# Altium schematic sheet [06] - NEON.SchDoc
size A3; DocumentNumber: 6; SheetNumber: 6; SheetTotal: 6
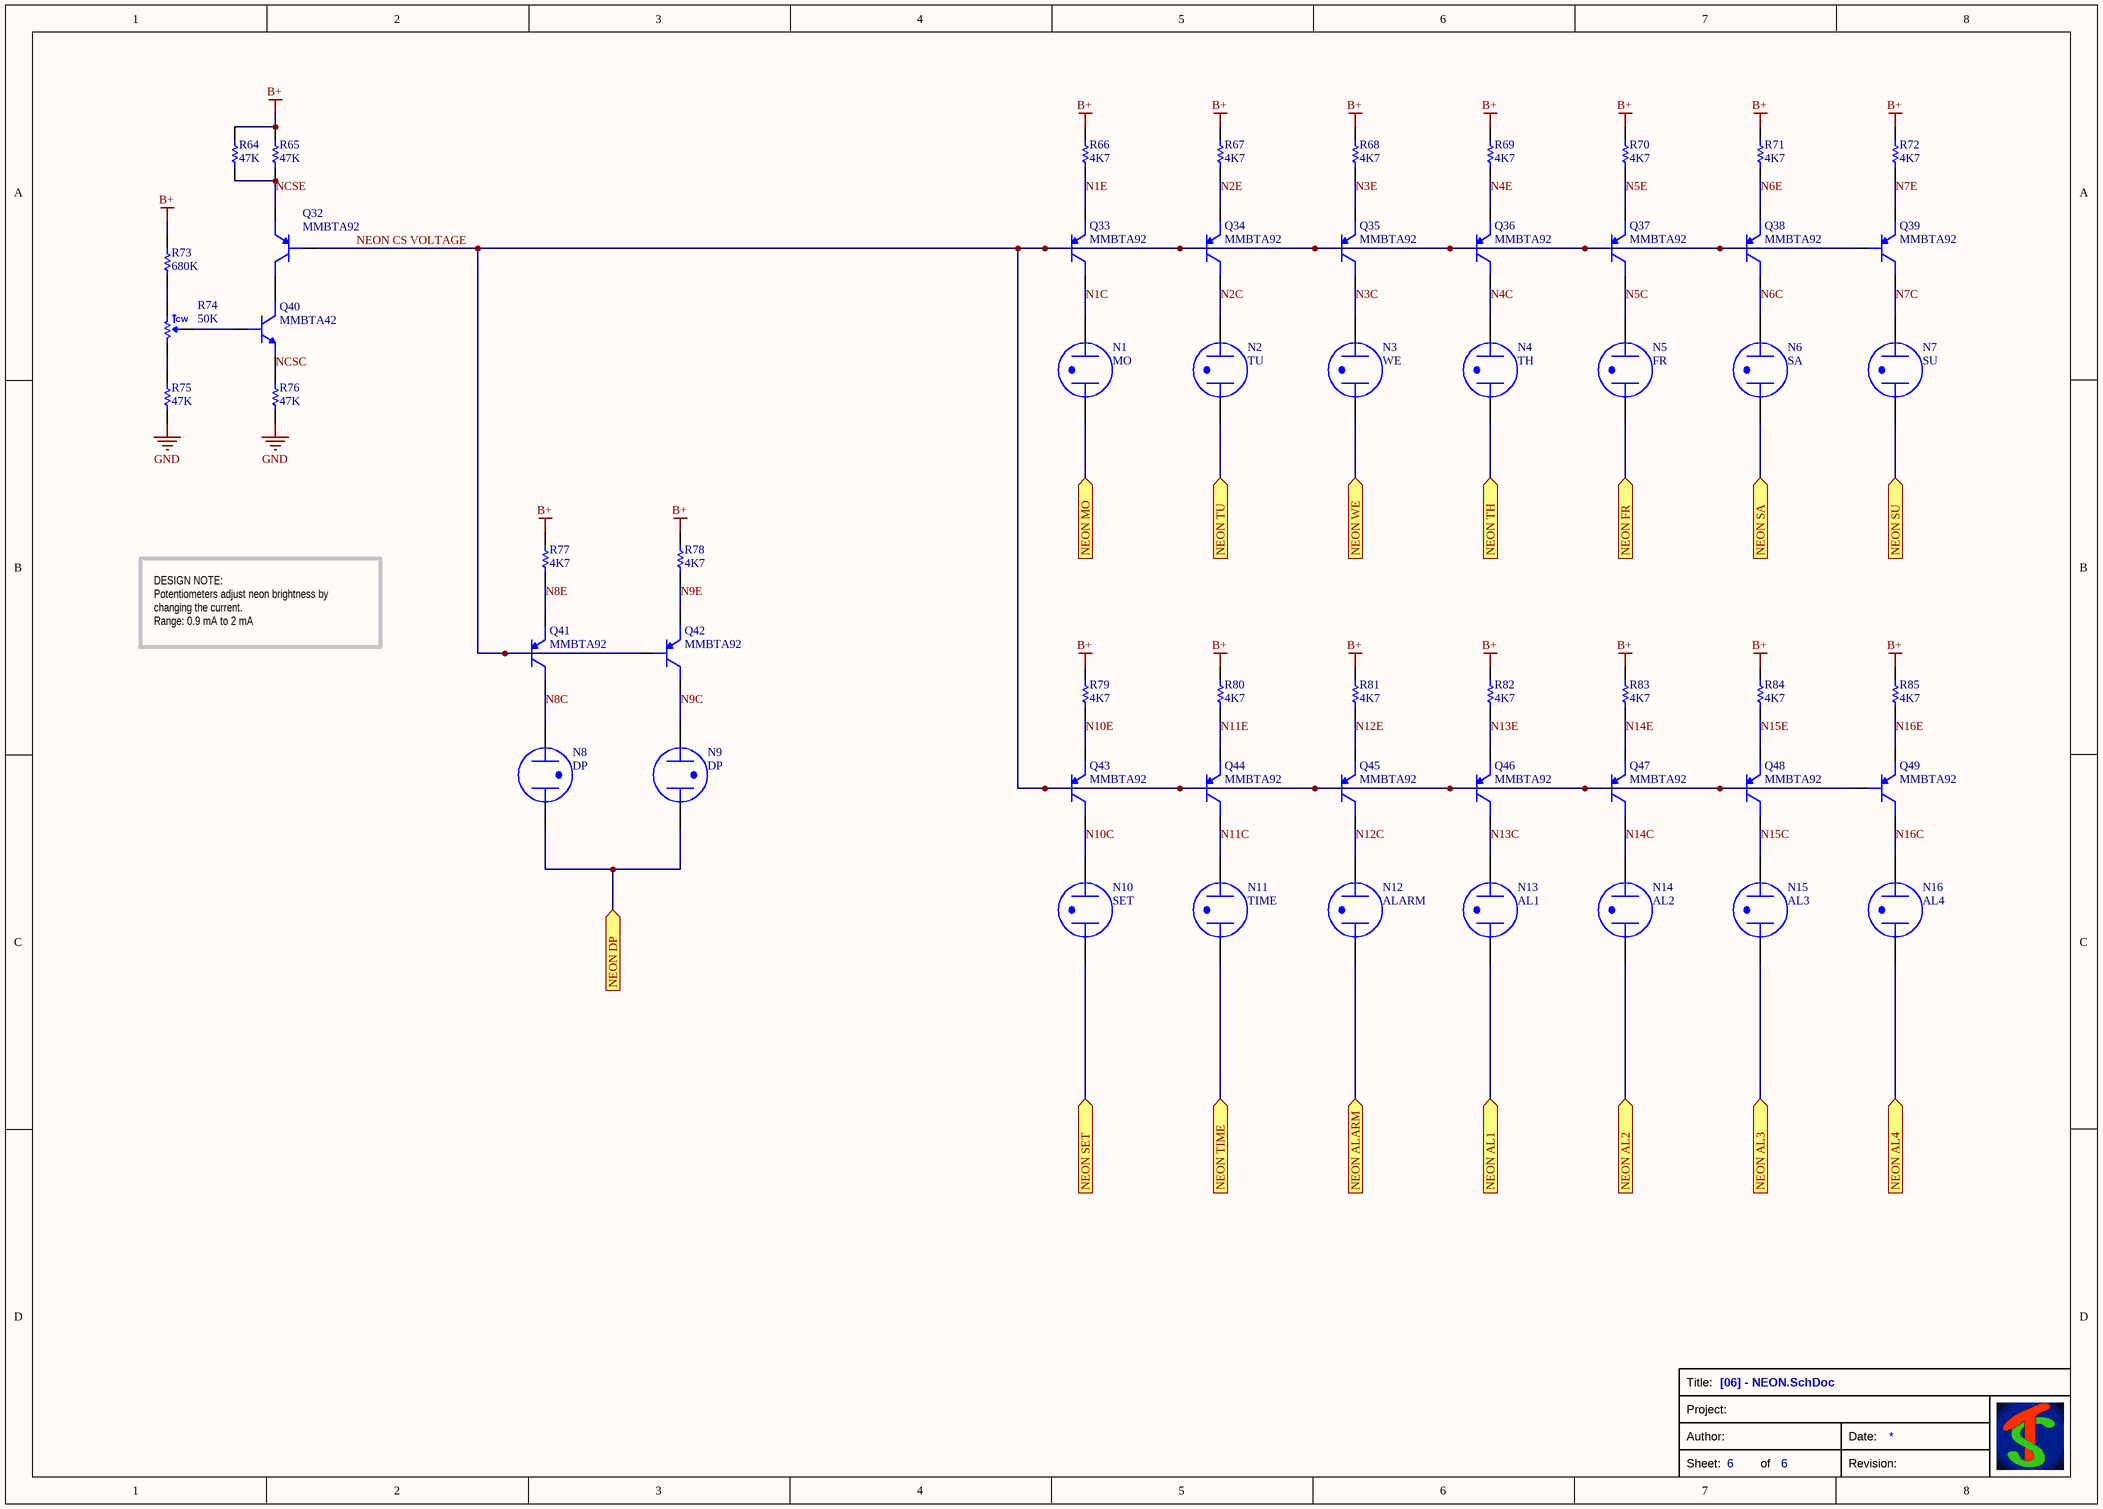
[diagram p0: [06] - NEON.SchDoc]

## Parts
N1  MO  [NE4 NEON LAMP]
N2  TU  [NE4 NEON LAMP]
N3  WE  [NE4 NEON LAMP]
N4  TH  [NE4 NEON LAMP]
N5  FR  [NE4 NEON LAMP]
N6  SA  [NE4 NEON LAMP]
N7  SU  [NE4 NEON LAMP]
N8  DP  [NE4 NEON LAMP]
N9  DP  [NE4 NEON LAMP]
N10  SET  [NE4 NEON LAMP]
N11  TIME  [NE4 NEON LAMP]
N12  ALARM  [NE4 NEON LAMP]
N13  AL1  [NE4 NEON LAMP]
N14  AL2  [NE4 NEON LAMP]
N15  AL3  [NE4 NEON LAMP]
N16  AL4  [NE4 NEON LAMP]
Q32  MMBTA92  [SOT95P240X110-3N]
Q33  MMBTA92  [SOT95P240X110-3N]
Q34  MMBTA92  [SOT95P240X110-3N]
Q35  MMBTA92  [SOT95P240X110-3N]
Q36  MMBTA92  [SOT95P240X110-3N]
Q37  MMBTA92  [SOT95P240X110-3N]
Q38  MMBTA92  [SOT95P240X110-3N]
Q39  MMBTA92  [SOT95P240X110-3N]
Q40  MMBTA42  [SOT95P240X110-3N]
Q41  MMBTA92  [SOT95P240X110-3N]
Q42  MMBTA92  [SOT95P240X110-3N]
Q43  MMBTA92  [SOT95P240X110-3N]
Q44  MMBTA92  [SOT95P240X110-3N]
Q45  MMBTA92  [SOT95P240X110-3N]
Q46  MMBTA92  [SOT95P240X110-3N]
Q47  MMBTA92  [SOT95P240X110-3N]
Q48  MMBTA92  [SOT95P240X110-3N]
Q49  MMBTA92  [SOT95P240X110-3N]
R64  value 47K  [RES-0805]  (hidden comment: RT0805FRE0747KL)
R65  value 47K  [RES-0805]  (hidden comment: RT0805FRE0747KL)
R66  value 4K7  [RES-0805]  (hidden comment: RT0805FRE134K7L)
R67  value 4K7  [RES-0805]  (hidden comment: RT0805FRE134K7L)
R68  value 4K7  [RES-0805]  (hidden comment: RT0805FRE134K7L)
R69  value 4K7  [RES-0805]  (hidden comment: RT0805FRE134K7L)
R70  value 4K7  [RES-0805]  (hidden comment: RT0805FRE134K7L)
R71  value 4K7  [RES-0805]  (hidden comment: RT0805FRE134K7L)
R72  value 4K7  [RES-0805]  (hidden comment: RT0805FRE134K7L)
R73  value 680K  [RES-1206]  (hidden comment: RT1206FRE07680KL)
R74  value 50K  [TC33X2503E]  (hidden comment: NEON)
R75  value 47K  [RES-0805]  (hidden comment: RT0805FRE0747KL)
R76  value 47K  [RES-0805]  (hidden comment: RT0805FRE0747KL)
R77  value 4K7  [RES-0805]  (hidden comment: RT0805FRE134K7L)
R78  value 4K7  [RES-0805]  (hidden comment: RT0805FRE134K7L)
R79  value 4K7  [RES-0805]  (hidden comment: RT0805FRE134K7L)
R80  value 4K7  [RES-0805]  (hidden comment: RT0805FRE134K7L)
R81  value 4K7  [RES-0805]  (hidden comment: RT0805FRE134K7L)
R82  value 4K7  [RES-0805]  (hidden comment: RT0805FRE134K7L)
R83  value 4K7  [RES-0805]  (hidden comment: RT0805FRE134K7L)
R84  value 4K7  [RES-0805]  (hidden comment: RT0805FRE134K7L)
R85  value 4K7  [RES-0805]  (hidden comment: RT0805FRE134K7L)

## Ports
NEON AL1 (in), NEON AL2 (in), NEON AL3 (in), NEON AL4 (in), NEON ALARM (in), NEON DP (in), NEON FR (in), NEON MO (in), NEON SA (in), NEON SET (in), NEON SU (in), NEON TH (in), NEON TIME (in), NEON TU (in), NEON WE (in)

## Nets
B+: R64.2 R65.2 R66.2 R67.2 R68.2 R69.2 R70.2 R71.2 R72.2 R73.2 R77.2 R78.2 R79.2 R80.2 R81.2 R82.2 R83.2 R84.2 R85.2
GND: R75.1 R76.1
N1C: N1.2 Q33.3(C)
N1E: Q33.2(E) R66.1
N2C: N2.2 Q34.3(C)
N2E: Q34.2(E) R67.1
N3C: N3.2 Q35.3(C)
N3E: Q35.2(E) R68.1
N4C: N4.2 Q36.3(C)
N4E: Q36.2(E) R69.1
N5C: N5.2 Q37.3(C)
N5E: Q37.2(E) R70.1
N6C: N6.2 Q38.3(C)
N6E: Q38.2(E) R71.1
N7C: N7.2 Q39.3(C)
N7E: Q39.2(E) R72.1
N8C: N8.1 Q41.3(C)
N8E: Q41.2(E) R77.1
N9C: N9.1 Q42.3(C)
N9E: Q42.2(E) R78.1
N10C: N10.2 Q43.3(C)
N10E: Q43.2(E) R79.1
N11C: N11.2 Q44.3(C)
N11E: Q44.2(E) R80.1
N12C: N12.2 Q45.3(C)
N12E: Q45.2(E) R81.1
N13C: N13.2 Q46.3(C)
N13E: Q46.2(E) R82.1
N14C: N14.2 Q47.3(C)
N14E: Q47.2(E) R83.1
N15C: N15.2 Q48.3(C)
N15E: Q48.2(E) R84.1
N16C: N16.2 Q49.3(C)
N16E: Q49.2(E) R85.1
NCSC: Q40.2(E) R76.2
NCSE: Q32.2(E) R64.1 R65.1
NEON AL1: N13.1 ; port NEON AL1
NEON AL2: N14.1 ; port NEON AL2
NEON AL3: N15.1 ; port NEON AL3
NEON AL4: N16.1 ; port NEON AL4
NEON ALARM: N12.1 ; port NEON ALARM
NEON CS VOLTAGE: Q32.1(B) Q33.1(B) Q34.1(B) Q35.1(B) Q36.1(B) Q37.1(B) Q38.1(B) Q39.1(B) Q41.1(B) Q42.1(B) Q43.1(B) Q44.1(B) Q45.1(B) Q46.1(B) Q47.1(B) Q48.1(B) Q49.1(B)
NEON DP: N8.2 N9.2 ; port NEON DP
NEON FR: N5.1 ; port NEON FR
NEON MO: N1.1 ; port NEON MO
NEON SA: N6.1 ; port NEON SA
NEON SET: N10.1 ; port NEON SET
NEON SU: N7.1 ; port NEON SU
NEON TH: N4.1 ; port NEON TH
NEON TIME: N11.1 ; port NEON TIME
NEON TU: N2.1 ; port NEON TU
NEON WE: N3.1 ; port NEON WE
NetQ32_3: Q32.3(C) Q40.3(C)
NetQ40_1: Q40.1(B) R74.2
NetR73_1: R73.1 R74.3
NetR74_1: R74.1 R75.2

## Notes on the sheet
- DESIGN NOTE:
  Potentiometers adjust neon brightness by changing the current.
  Range: 0.9 mA to 2 mA
- Title:
- Project:
- Sheet:
- Author:
- of
- Revision:
- Date:
- (in symbol POT-50K-TC33X-2-503E) CW

## Library data of the parts
N1-N16 = T4-NEON-LAMP: Lampade Std. Brightness Neon Lamp Tin Leads; Supplier 1: Mouser; Supplier Part Number 1: 696-GT-NE4H1125
Q32-Q39 Q41-Q49 = PNP-MMBTA92: 300V PNP SMALL SIGNAL TRANSISTOR IN SOT23; Supplier 1: Mouser; Supplier Part Number 1: 621-MMBTA92-F
Q40 = NPN-MMBTA42: 300V NPN SMALL SIGNAL TRANSISTOR IN SOT23; Supplier 1: Mouser; Supplier Part Number 1: 621-MMBTA42-F
R64 R65 R75 R76 = RES-0805-47K-RT0805FRE0747KL: Thin Film Resistors 1/8W 47K ohm 1% 50ppm; Manufacturer: Yageo; Power Rating: 1/10W; Voltage Rating: 75V; Tolerance: 1%; Supplier 1: Mouser; Supplier Part Number 1: 603-RT0805FRE0747KL
R66-R72 R77-R85 = RES-0805-4K7-RT0805FRE134K7L: Thin Film Resistors 4.7K ohm 1% 50 ppm; Manufacturer: Yageo; Power Rating: 1/10W; Voltage Rating: 75V; Tolerance: 1%; Supplier 1: Mouser; Supplier Part Number 1: 603-RT0805FRE134K7L
R73 = RES-1206-680K-RT1206FRE07680KL: Thin Film Resistors 680K OHM 1% 50PPM 1/4W; Manufacturer: Yageo; Power Rating: 1/10W; Voltage Rating: 75V; Tolerance: 1%; Supplier 1: Mouser; Supplier Part Number 1: 603-RT1206FRE07680KL
R74 = POT-50K-TC33X-2-503E: Resistenze trimmer - SMD 3MM 50KOHMS 25% 0.1WATT OPEN FRM; Manufacturer: Yageo; Power Rating: 1/10W; Voltage Rating: 75V; Tolerance: 1%; Supplier 1: Mouser; Supplier Part Number 1: 652-TC33X-2-503E